# EAGLE design DE100-hw (EAGLE 9.6.2)
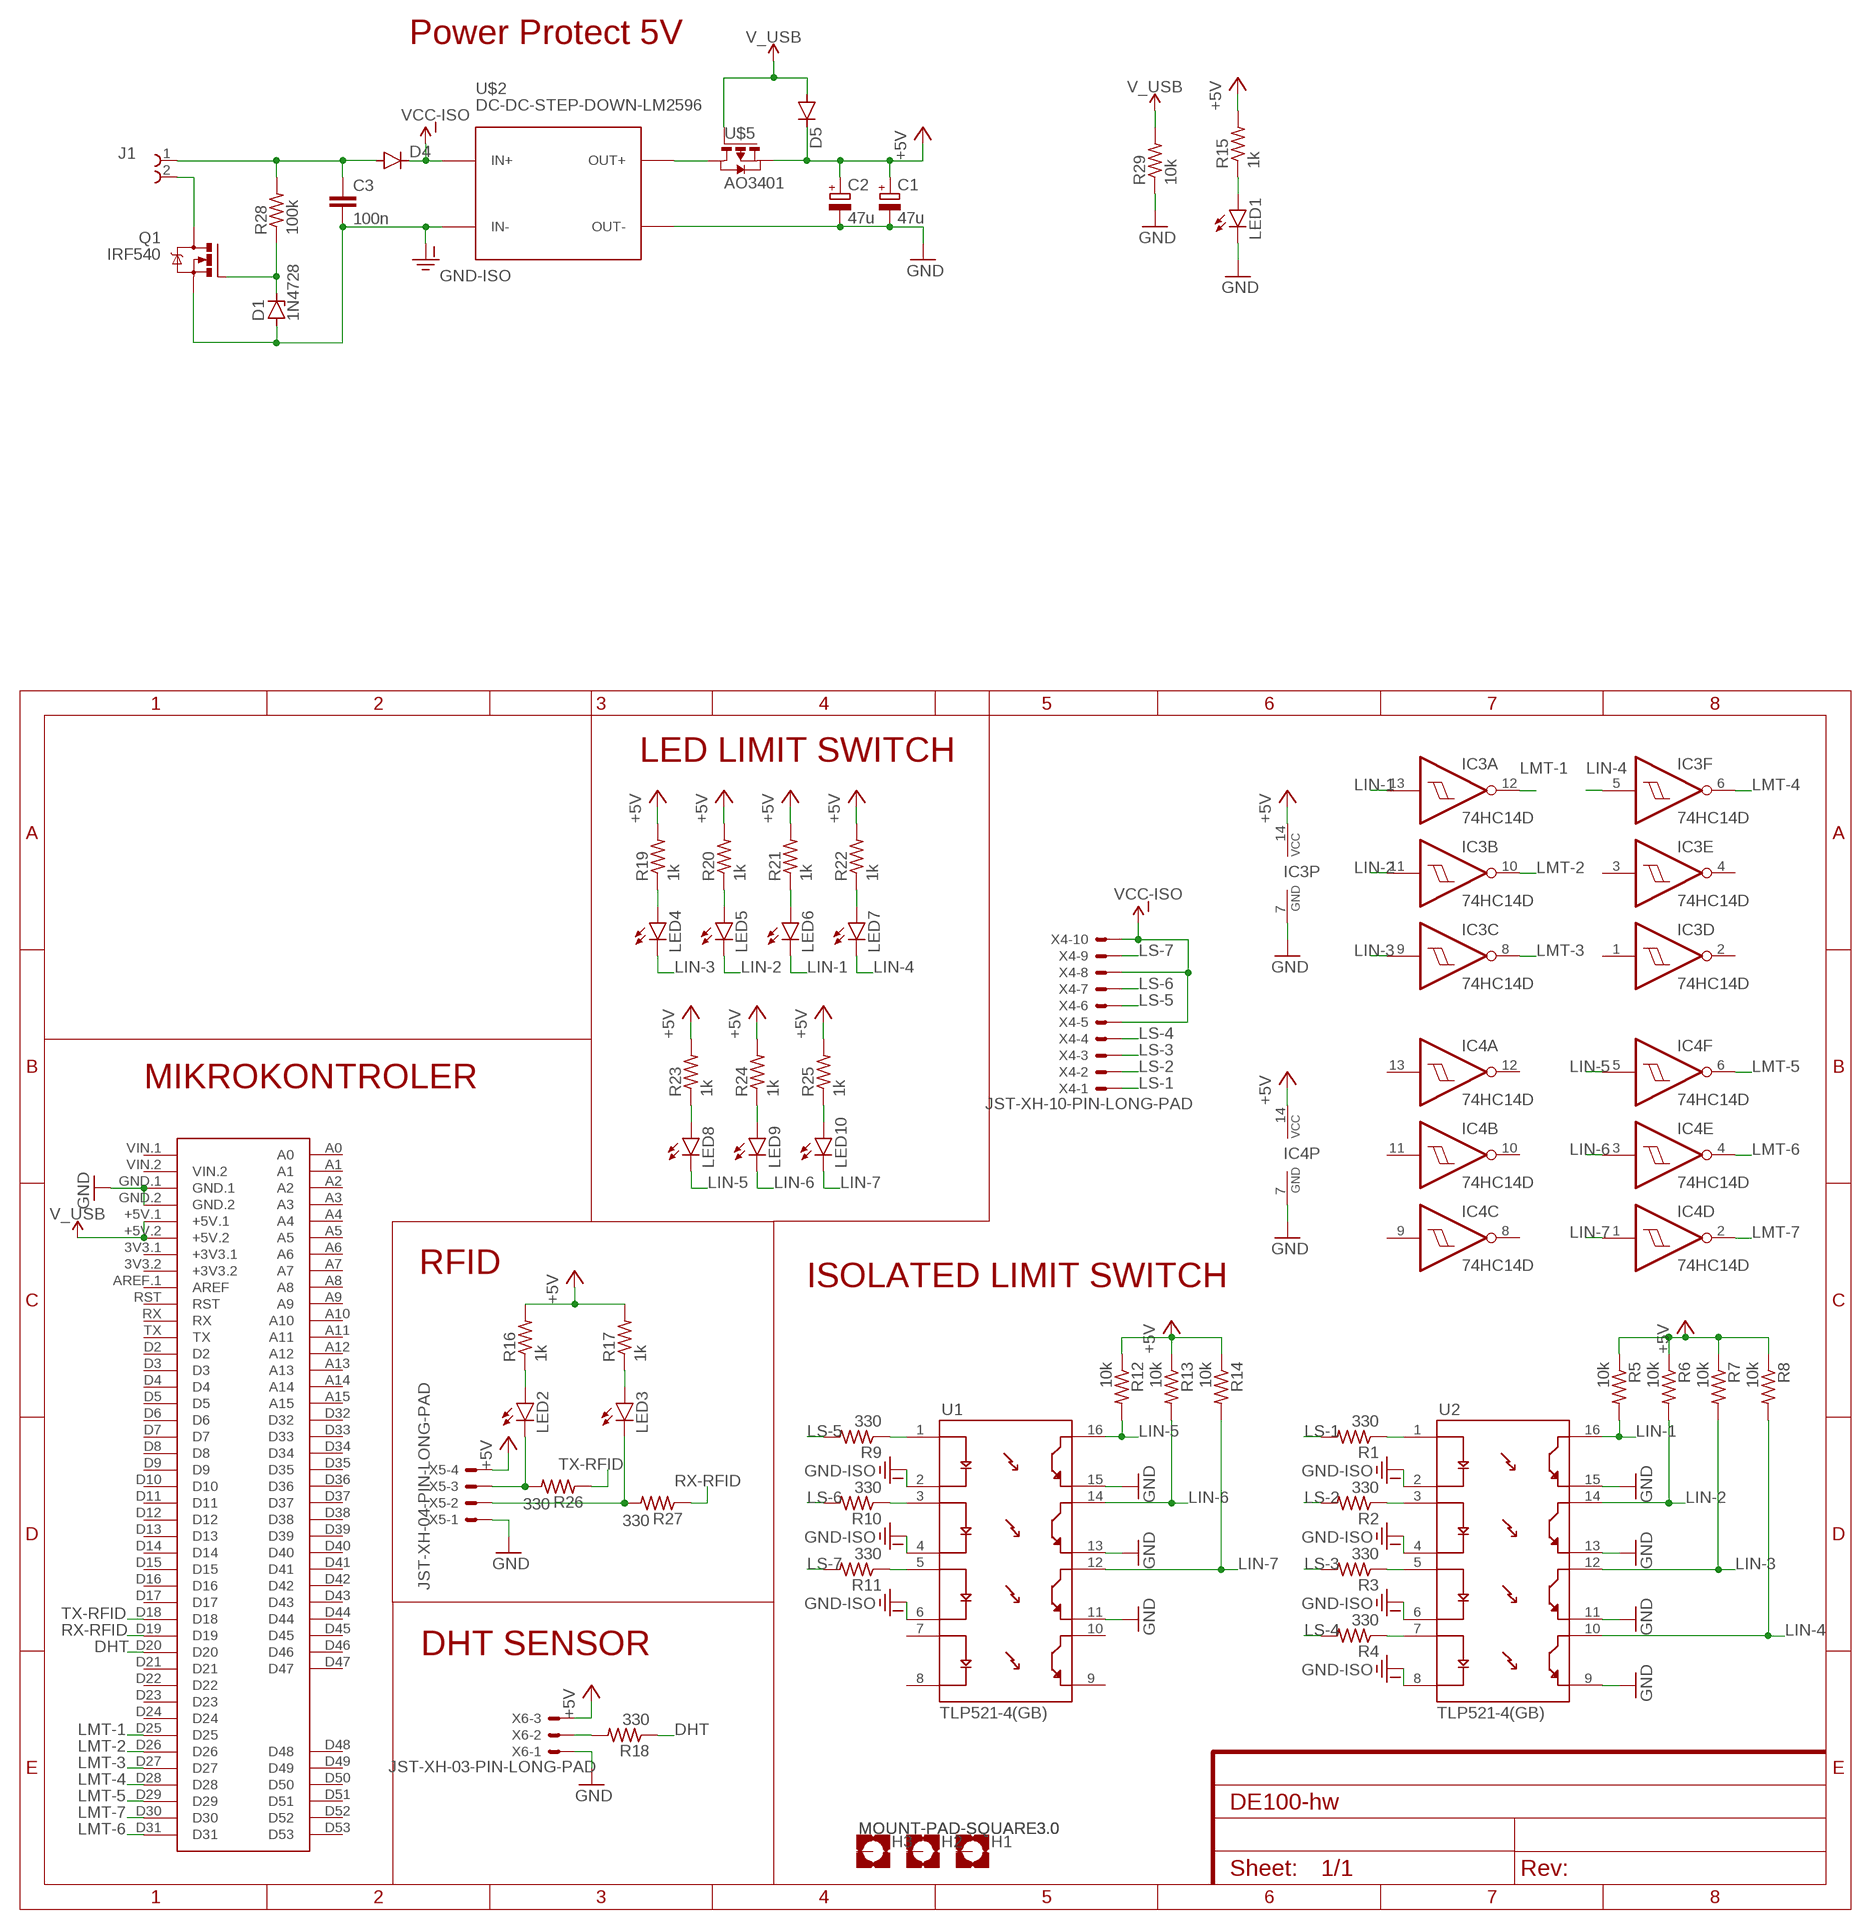
[diagram p0: schematic, sheet 1]

## Parts
C1  47u  CPOL-EUUD-6,3X8,8  [UD-6,3X5,8_NICHICON]
C2  47u  CPOL-EUUD-6,3X8,8  [UD-6,3X5,8_NICHICON]
C3  100n  C-EUC0805K  [C0805K]
D1  1N4728  [DO41Z10]
D4  DIODE-DO-214AC  [DO-214AC]
D5  DIODE-DO-214AC  [DO-214AC]
H1  MOUNT-PAD-SQUARE3.0  [3,0-PAD-SQUARE]
H2  MOUNT-PAD-SQUARE3.0  [3,0-PAD-SQUARE]
H3  MOUNT-PAD-SQUARE3.0  [3,0-PAD-SQUARE]
IC3  74HC14D  [SO14]
IC4  74HC14D  [SO14]
J1  691312510002  [691312510002]
LED1  LEDCHIPLED_0805  [CHIPLED_0805]
LED2  LEDCHIPLED_0805  [CHIPLED_0805]
LED3  LEDCHIPLED_0805  [CHIPLED_0805]
LED4  LEDCHIPLED_0805  [CHIPLED_0805]
LED5  LEDCHIPLED_0805  [CHIPLED_0805]
LED6  LEDCHIPLED_0805  [CHIPLED_0805]
LED7  LEDCHIPLED_0805  [CHIPLED_0805]
LED8  LEDCHIPLED_0805  [CHIPLED_0805]
LED9  LEDCHIPLED_0805  [CHIPLED_0805]
LED10  LEDCHIPLED_0805  [CHIPLED_0805]
Q1  IRF540  [TO220BV]
R1  330  R-US_R0805  [R0805]
R2  330  R-US_R0805  [R0805]
R3  330  R-US_R0805  [R0805]
R4  330  R-US_R0805  [R0805]
R5  10k  R-US_R0805  [R0805]
R6  10k  R-US_R0805  [R0805]
R7  10k  R-US_R0805  [R0805]
R8  10k  R-US_R0805  [R0805]
R9  330  R-US_R0805  [R0805]
R10  330  R-US_R0805  [R0805]
R11  330  R-US_R0805  [R0805]
R12  10k  R-US_R0805  [R0805]
R13  10k  R-US_R0805  [R0805]
R14  10k  R-US_R0805  [R0805]
R15  1k  R-US_R0805  [R0805]
R16  1k  R-US_R0805  [R0805]
R17  1k  R-US_R0805  [R0805]
R18  330  R-US_R0805  [R0805]
R19  1k  R-US_R0805  [R0805]
R20  1k  R-US_R0805  [R0805]
R21  1k  R-US_R0805  [R0805]
R22  1k  R-US_R0805  [R0805]
R23  1k  R-US_R0805  [R0805]
R24  1k  R-US_R0805  [R0805]
R25  1k  R-US_R0805  [R0805]
R26  330  R-US_R0805  [R0805]
R27  330  R-US_R0805  [R0805]
R28  100k  R-US_R0805  [R0805]
R29  10k  R-US_R0805  [R0805]
U1  TLP521-4(GB)  [DIP762W50P254L2007H485Q16]
U2  TLP521-4(GB)  [DIP762W50P254L2007H485Q16]
U$1  MEGA2560_MIKRO  [MEGA2560_MIKRO]
U$2  DC-DC-STEP-DOWN-LM2596  [DC-DC-STEP-DOWN-LM2596]
U$5  AO3401  [SOT23]
X4  JST-XH-10-PIN-LONG-PAD  [JST-XH-10-PACKAGE-LONG-PAD]
X5  JST-XH-04-PIN-LONG-PAD  [JST-XH-04-PACKAGE-LONG-PAD]
X6  JST-XH-03-PIN-LONG-PAD  [JST-XH-03-PACKAGE-LONG-PAD]

## Nets
+5V: C1.+ C2.+ D5.C IC3.14(P:VCC) IC4.14(P:VCC) R5.1 R6.1 R7.1 R8.1 R12.1 R13.1 R14.1 R15.2 R16.2 R17.2 R19.2 R20.2 R21.2 R22.2 R23.2 R24.2 R25.2 U$5.2(S) X5.4 X6.3
DHT: R18.1 U$1.D20
GND: C1.- C2.- IC3.7(P:GND) IC4.7(P:GND) LED1.C R29.1 U1.11(ET3) U1.13(ET2) U1.15(ET1) U2.9(ET4) U2.11(ET3) U2.13(ET2) U2.15(ET1) U$1.GND.1 U$1.GND.2 U$2.OUT- X5.1 X6.1
GND-ISO: C3.2 D1.A Q1.S U1.2(C1) U1.4(C2) U1.6(C3) U2.2(C1) U2.4(C2) U2.6(C3) U2.8(C4) U$2.IN-
LIN-1: IC3.13(A:I) LED6.C R5.2 U2.16(CT1)
LIN-2: IC3.11(B:I) LED5.C R6.2 U2.14(CT2)
LIN-3: IC3.9(C:I) LED4.C R7.2 U2.12(CT3)
LIN-4: IC3.5(F:I) LED7.C R8.2 U2.10(CT4)
LIN-5: IC4.5(F:I) LED8.C R12.2 U1.16(CT1)
LIN-6: IC4.3(E:I) LED9.C R13.2 U1.14(CT2)
LIN-7: IC4.1(D:I) LED10.C R14.2 U1.12(CT3)
LMT-1: IC3.12(A:O) U$1.D25
LMT-2: IC3.10(B:O) U$1.D26
LMT-3: IC3.8(C:O) U$1.D27
LMT-4: IC3.6(F:O) U$1.D28
LMT-5: IC4.6(F:O) U$1.D29
LMT-6: IC4.4(E:O) U$1.D31
LMT-7: IC4.2(D:O) U$1.D30
LS-1: R1.2 X4.1
LS-2: R2.2 X4.2
LS-3: R3.2 X4.3
LS-4: R4.2 X4.4
LS-5: R9.2 X4.6
LS-6: R10.2 X4.7
LS-7: R11.2 X4.9
N$1: J1.2 Q1.D
N$2: U$2.OUT+ U$5.3(D)
N$3: D1.C Q1.G R28.1
N$4: C3.1 D4.A J1.1 R28.2
N$17: LED1.A R15.1
N$18: LED2.A R16.1
N$23: LED3.A R17.1
N$24: R1.1 U2.1(A1)
N$25: R2.1 U2.3(A2)
N$26: R3.1 U2.5(A3)
N$27: R4.1 U2.7(A4)
N$32: R9.1 U1.1(A1)
N$33: R10.1 U1.3(A2)
N$34: R11.1 U1.5(A3)
N$35: LED2.C R26.2 X5.3
N$36: LED3.C R27.2 X5.2
N$37: LED4.A R19.1
N$38: R18.2 X6.2
N$41: LED5.A R20.1
N$44: LED6.A R21.1
N$49: LED7.A R22.1
N$50: LED8.A R23.1
N$51: LED9.A R24.1
N$52: LED10.A R25.1
RX-RFID: R27.1 U$1.D19
TX-RFID: R26.1 U$1.D18
V_USB: D5.A R29.2 U$1.+5V.1 U$1.+5V.2 U$5.1(G)
VCC-ISO: D4.C U$2.IN+ X4.5 X4.8 X4.10
Unconnected: H1.B3,0(MOUNT) H2.B3,0(MOUNT) H3.B3,0(MOUNT) IC3.1(D:I) IC3.2(D:O) IC3.3(E:I) IC3.4(E:O) IC4.8(C:O) IC4.9(C:I) IC4.10(B:O) IC4.11(B:I) IC4.12(A:O) IC4.13(A:I) U1.7(A4) U1.8(C4) U1.9(ET4) U1.10(CT4) U$1.3V3.1(+3V3.1) U$1.3V3.2(+3V3.2) U$1.A0 U$1.A1 U$1.A2 U$1.A3 U$1.A4 U$1.A5 U$1.A6 U$1.A7 U$1.A8 U$1.A9 U$1.A10 U$1.A11 U$1.A12 U$1.A13 U$1.A14 U$1.A15 U$1.AREF.1(AREF) U$1.D2 U$1.D3 U$1.D4 U$1.D5 U$1.D6 U$1.D7 U$1.D8 U$1.D9 U$1.D10 U$1.D11 U$1.D12 U$1.D13 U$1.D14 U$1.D15 U$1.D16 U$1.D17 U$1.D21 U$1.D22 U$1.D23 U$1.D24 U$1.D32 U$1.D33 U$1.D34 U$1.D35 U$1.D36 U$1.D37 U$1.D38 U$1.D39 U$1.D40 U$1.D41 U$1.D42 U$1.D43 U$1.D44 U$1.D45 U$1.D46 U$1.D47 U$1.D48 U$1.D49 U$1.D50 U$1.D51 U$1.D52 U$1.D53 U$1.RST U$1.RX U$1.TX U$1.VIN.1 U$1.VIN.2

## Notes on the sheet
- Power Protect 5V
- LED LIMIT SWITCH
- MIKROKONTROLER
- RFID
- ISOLATED LIMIT SWITCH
- DHT SENSOR

## Library data of the parts
C1 C2 = rcl:CPOL-EU: POLARIZED CAPACITOR, European symbol; SPICEPREFIX: C
C3 = rcl:C-EU: CAPACITOR, European symbol; SPICEPREFIX: C
D1 = diode:1N4728: Z DIODE 3.3 V, 1W, 5 percent
D4 D5 = diode:DIODE-: DIODE
H1-H3 = holes:MOUNT-PAD-SQUARE: MOUNTING PAD, square
IC3 IC4 = 74xx-eu:74*14: Hex schmitt trigger INVERTER
J1 = Wurth_Elektronik_Electromechanic_Terminal_Blocks_Connectors_rev16b:691312510002: WR-TBL Serie 312 - 5.08 mm Open Horizontal PCB Header , 2 Pins=>Code : Con_TBL_Pluggable_5.08_PCB_THT_Simple_H_691312510002 <http://katalog.we-online.de/media/images/eican/Con_TBL_Pluggable_5.08_PCB_THT_Simple_H_6913125100xx_pf2.jpg> Details see: http://katalog.we-online.de/en/em/691_312_510_0xx Created 2014-06-25, Karrer Zheng 2014 (C) Würth Elektronik
LED1-LED10 = led:LED: LED OSRAM: - CHIPLED LG R971, LG N971, LY N971, LG Q971, LY Q971, LO R971, LY R971 LH N974, LH R974 LS Q976, LO Q976, LY Q976 LO Q996 - Hyper CHIPLED LW Q18S LB Q993, LB Q99A, LB R99A - SideLED LS A670, LO A670, LY A670, LG A670, LP A670 LB A673, LV A673, LT A673, LW A673 LH A674 LY A675 LS A676, LA A676, LO A676, LY A676, LW A676 LS A679, LY A679, LG A679 - Hyper Micro SIDELED® LS Y876, LA Y876, LO Y876, LY Y876 LT Y87S - SmartLED LW L88C, LW L88S LB L89C, LB L89S, LG L890 LS L89K, LO L89K, LY L89K LS L896, LA L896, LO L896, LY L896 - TOPLED LS T670, LO T670, LY T670, LG T670, LP T670 LSG T670, LSP T670, LSY T670, LOP T670, LYG T670 LG T671, LOG T671, LSG T671 LB T673, LV T673, LT T673, LW T673 LH T674 LS T676, LA T676, LO T676, LY T676, LB T676, LH T676, LSB T676, LW T676 LB T67C, LV T67C, LT T67C, LS T67K, LO T67K, LY T67K, LW E67C LS E67B, LA E67B, LO E67B, LY E67B, LB E67C, LV E67C, LT E67C LW T67C LS T679, LY T679, LG T679 LS T770, LO T770, LY T770, LG T770, LP T770 LB T773, LV T773, LT T773, LW T773 LH T774 LS E675, LA E675, LY E675, LS T675 LS T776, LA T776, LO T776, LY T776, LB T776 LHGB T686 LT T68C, LB T68C - Hyper Mini TOPLED® LB M676 - Mini TOPLED Santana® LG M470 LS M47K, LO M47K, LY M47K Source: http://www.osram.convergy.de LUXEON: - LUMILED® LXK2-PW12-R00, LXK2-PW12-S00, LXK2-PW14-U00, LXK2-PW14-V00 LXK2-PM12-R00, LXK2-PM12-S00, LXK2-PM14-U00 LXK2-PE12-Q00, LXK2-PE12-R00, LXK2-PE12-S00, LXK2-PE14-T00, LXK2-PE14-U00 LXK2-PB12-K00, LXK2-PB12-L00, LXK2-PB12-M00, LXK2-PB14-N00, LXK2-PB14-P00, LXK2-PB14-Q00 LXK2-PR12-L00, LXK2-PR12-M00, LXK2-PR14-Q00, LXK2-PR14-R00 LXK2-PD12-Q00, LXK2-PD12-R00, LXK2-PD12-S00 LXK2-PH12-R00, LXK2-PH12-S00 LXK2-PL12-P00, LXK2-PL12-Q00, LXK2-PL12-R00 Source: www.luxeon.com KINGBRIGHT: KA-3528ASYC Source: www.kingbright.com
Q1 = transistor-power:IRF540: HEXFET Power MOSFET
R1-R29 = rcl:R-US_: RESISTOR, American symbol; SPICEPREFIX: R
U1 U2 = TLP521-4_GB_:TLP521-4(GB): Optocoupler, Quad, Transistor o/p; AVAILABILITY: Unavailable; DESCRIPTION: Optocoupler, Quad, Transistor o/p; MF: Toshiba; MP: TLP521-4_GB_; PACKAGE: DIP-16 Toshiba; PRICE: None
U$1 = MIKRO_MEGA2560:MEGA2560_MIKRO: Arduino Mega2560 pro robotDyn, create by mikroavr.com
U$2 = diy-modules:DC-DC-STEP-DOWN-LM2596: DC/DC Step-Down Regulator based on LM2596-ADJ chip LM2596 datasheet available here: http://www.ti.com/lit/ds/symlink/lm2596.pdf Click here to find device on ebay.com <http://www.ebay.com/sch/lm2596+power+regulator>
U$5 = AO3401:AO3401: Check prices <https://pricing.snapeda.com/parts/AO3401/Alpha%20%26%20Omega%20Semiconductor/view-part?ref=eda>; AVAILABILITY: Warning; DESCRIPTION: P-Channel 30V 4A (Ta) 1.4W (Ta) Surface Mount SOT-23-3L; MF: Alpha & Omega Semiconductor; MP: AO3401; PACKAGE: SOT-23-3 Alpha &amp; Omega Semiconductor; PRICE: None
X4 = Rembrandt Electronics - JST XH Connectors v1-0:JST-XH-10-PIN: JST XH Connector 2 Pin Wire to board connector. Pitch: 2,54 mm, (0.100") Number of pins: 10 Created by Rembrandt Electronics www.rembrandtelectronics.com
X5 = Rembrandt Electronics - JST XH Connectors v1-0:JST-XH-04-PIN: JST XH Connector 2 Pin Wire to board connector. Pitch: 2,54 mm, (0.100") Number of pins: 4 Created by Rembrandt Electronics www.rembrandtelectronics.com
X6 = Rembrandt Electronics - JST XH Connectors v1-0:JST-XH-03-PIN: JST XH Connector 2 Pin Wire to board connector. Pitch: 2,54 mm, (0.100") Number of pins: 3 Created by Rembrandt Electronics www.rembrandtelectronics.com

## Board
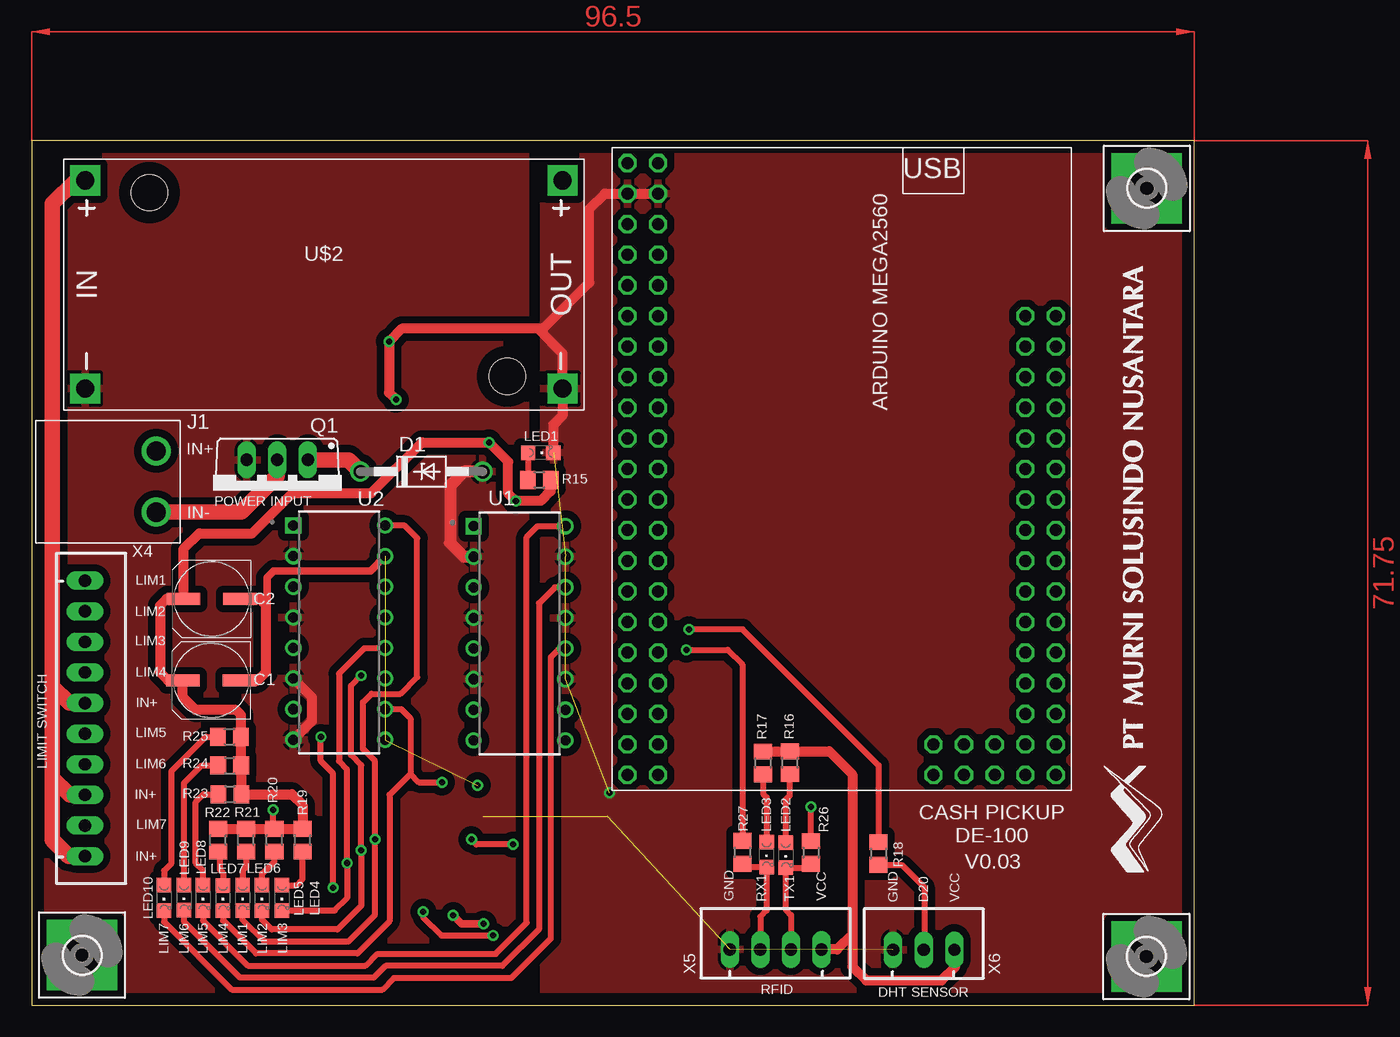
[diagram p1: board, top side]
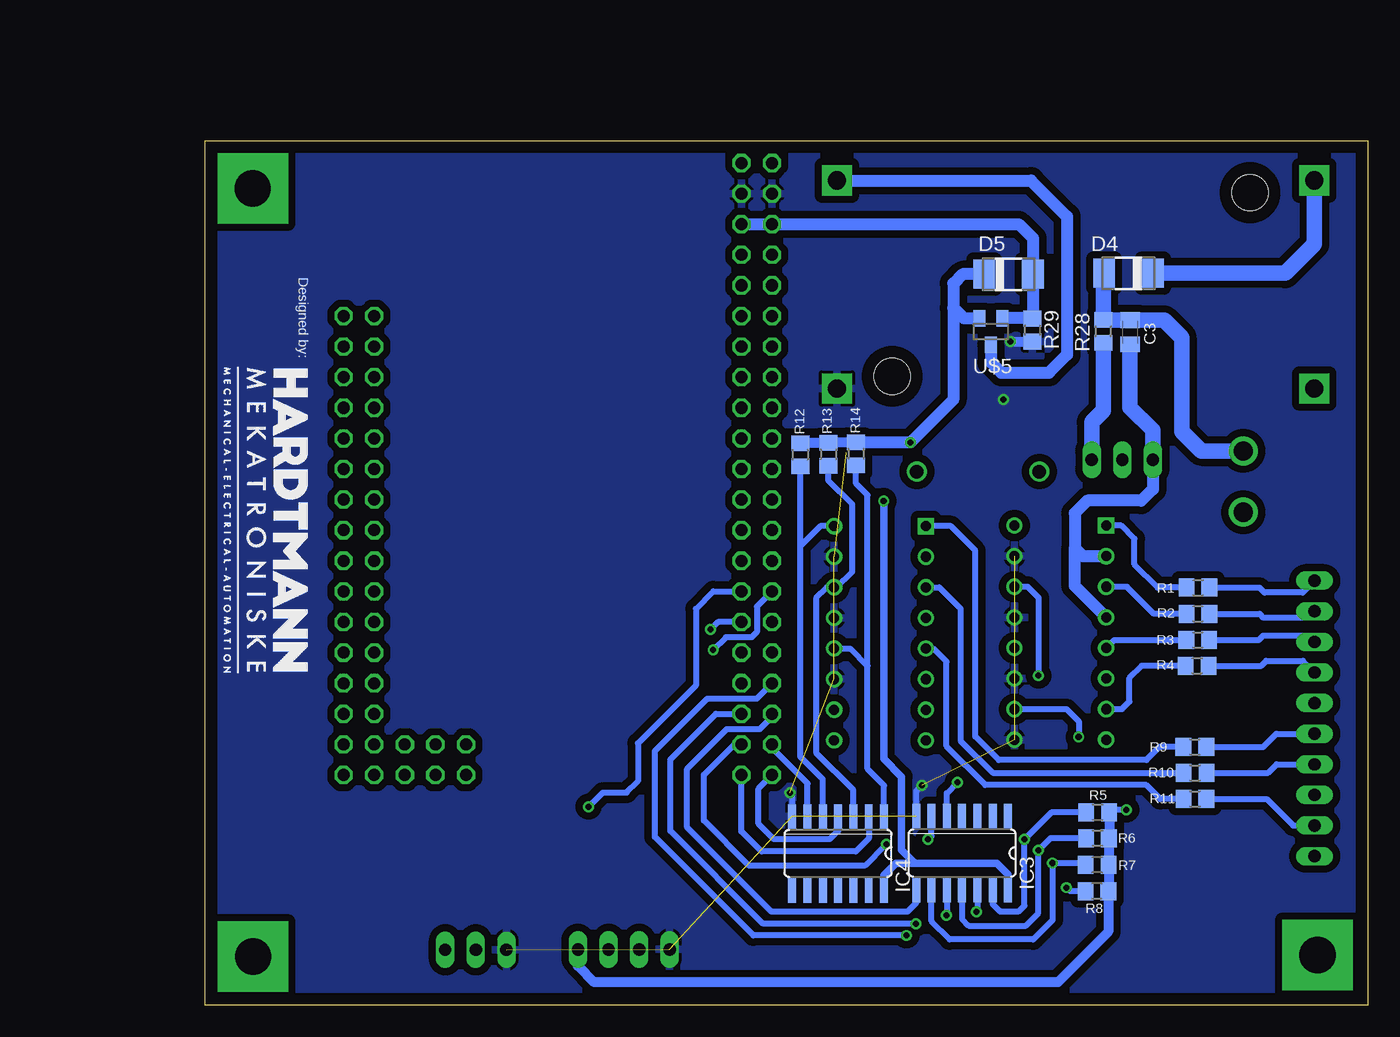
[diagram p2: board, bottom side, seen from below]

Size 96.5 x 71.75 mm. Coordinates in mm from the lower left corner, seen from the top.
Outline: 0,0 96.5,0 96.5,71.75 0,71.75 0,0
Copper layers (1*16): Top 0.035mm / dielectric 1.5mm / Bottom 0.035mm
Design rules "Multikarya": minimum track width 0.2mm, minimum drill 0.35mm, track to track 0.2mm, track to pad 0.2mm, pad to pad 0.2mm, via to via 0.2mm, smd to smd 0.2mm, copper to edge 40mil, drill to drill 6mil, minimum pad ring 10mil, minimum via ring 8mil, stop-mask expansion 4mil, vias tented up to drill 0mil, thermal gap 10mil

### Footprints (pad centres in the part's own frame; a part is rotated, then mirrored left to right if it is on the bottom)
UD-6,3X5,8_NICHICON = smd 2.8 x 1: + 2.35,0; - -2.35,0
C0805K = smd 1.3 x 1.6: 1 -1,0; 2 1,0
DO41Z10 = drill 1.118: A 5.08,0; C -5.08,0
DO-214AC = smd 1.8 x 2.4: A 2.025,0; C -2.025,0
3,0-PAD-SQUARE = drill 3 pad 5.842 square: B3,0 0,0
SO14 = smd 0.66 x 2.032: 1 -3.81,-3.073; 2 -2.54,-3.073; 3 -1.27,-3.073; 4 0,-3.073; 5 1.27,-3.073; 6 2.54,-3.073; 7 3.81,-3.073; 8 3.81,3.073; 9 2.54,3.073; 10 1.27,3.073; 11 0,3.073; 12 -1.27,3.073; 13 -2.54,3.073; 14 -3.81,3.073
691312510002 = drill 1.6: 1 -5.08,0; 2 0,0
CHIPLED_0805 = smd 1.2 x 1.2: A 0,-1.05; C 0,1.05
TO220BV = drill 1.016 long: D 0,-2.54; G -2.54,-2.54; S 2.54,-2.54
R0805 = smd 1.3 x 1.5: 1 -0.95,0; 2 0.95,0
DIP762W50P254L2007H485Q16 = drill 0.84 square: 1 -3.81,8.89 | drill 0.84: 2 -3.81,6.35; 3 -3.81,3.81; 4 -3.81,1.27; 5 -3.81,-1.27; 6 -3.81,-3.81; 7 -3.81,-6.35; 8 -3.81,-8.89; 9 3.81,-8.89; 10 3.81,-6.35; 11 3.81,-3.81; 12 3.81,-1.27; 13 3.81,1.27; 14 3.81,3.81; 15 3.81,6.35; 16 3.81,8.89
MEGA2560_MIKRO = drill 1 octagon: 3V3.1 -26.67,-17.78; 3V3.2 -26.67,-20.32; +5V.1 -29.21,-17.78; +5V.2 -29.21,-20.32; A0 -21.59,15.24; A1 -21.59,12.7; A2 -19.05,15.24; A3 -19.05,12.7; A4 -16.51,15.24; A5 -16.51,12.7; A6 -13.97,15.24; A7 -13.97,12.7; A8 -11.43,15.24; A9 -11.43,12.7; A10 -8.89,15.24; A11 -8.89,12.7; A12 -6.35,15.24; A13 -6.35,12.7; A14 -3.81,15.24; A15 -3.81,12.7; AREF.1 -24.13,-17.78; D2 -19.05,-17.78; D3 -19.05,-20.32; D4 -16.51,-17.78; D5 -16.51,-20.32; D6 -13.97,-17.78; D7 -13.97,-20.32; D8 -11.43,-17.78; D9 -11.43,-20.32; D10 -8.89,-17.78; D11 -8.89,-20.32; D12 -6.35,-17.78; D13 -6.35,-20.32; D14 -3.81,-17.78; D15 -3.81,-20.32; D16 -1.27,-17.78; D17 -1.27,-20.32; D18 1.27,-17.78; D19 1.27,-20.32; D20 3.81,-17.78; D21 3.81,-20.32; D22 6.35,-17.78; D23 6.35,-20.32; D24 8.89,-17.78; D25 8.89,-20.32; D26 11.43,-17.78; D27 11.43,-20.32; D28 13.97,-17.78; D29 13.97,-20.32; D30 16.51,-17.78; D31 16.51,-20.32; D32 -1.27,15.24; D33 -1.27,12.7; D34 1.27,15.24; D35 1.27,12.7; D36 3.81,15.24; D37 3.81,12.7; D38 6.35,15.24; D39 6.35,12.7; D40 8.89,15.24; D41 8.89,12.7; D42 11.43,15.24; D43 11.43,12.7; D44 13.97,15.24; D45 13.97,12.7; D46 16.51,15.24; D47 16.51,12.7; D48 16.51,10.16; D49 13.97,10.16; D50 16.51,7.62; D51 13.97,7.62; D52 16.51,5.08; D53 13.97,5.08; GND.1 -31.75,-17.78; GND.2 -31.75,-20.32; RST -24.13,-20.32; RX -21.59,-17.78; TX -21.59,-20.32; VIN.1 -34.29,-17.78; VIN.2 -34.29,-20.32
DC-DC-STEP-DOWN-LM2596 = drill 1.5 pad 2.5 square: IN+ -19.812,8.636; IN- -19.812,-8.636; OUT+ 19.812,8.636; OUT- 19.812,-8.636 | hole 3: -14.478,7.62; 15.24,-7.62
SOT23 = smd 1 x 1.4: 1 -0.95,-1.1; 2 0.95,-1.1; 3 0,1.1
JST-XH-10-PACKAGE-LONG-PAD = drill 1.016 long: 1 -11.43,0; 2 -8.89,0; 3 -6.35,0; 4 -3.81,0; 5 -1.27,0; 6 1.27,0; 7 3.81,0; 8 6.35,0; 9 8.89,0; 10 11.43,0
JST-XH-04-PACKAGE-LONG-PAD = drill 1.016 long: 1 -3.81,0; 2 -1.27,0; 3 1.27,0; 4 3.81,0
JST-XH-03-PACKAGE-LONG-PAD = drill 1.016 long: 1 -2.54,0; 2 0,0; 3 2.54,0

### Placement (x,y rotation side)
C1  14.89,26.95 180 top
C2  14.94,33.72 180 top
C3  19.73,55.85 270 bottom
D1  32.34,44.28 0 top
D4  19.87,60.74 180 bottom
D5  29.81,60.67 0 bottom
H1  4.17,4.15 0 top
H2  92.51,4.04 0 top
H3  92.54,67.79 0 top
IC3  33.67,12.61 180 bottom
IC4  43.96,12.59 180 bottom
J1  10.33,40.92 270 top
LED1  42.24,45.85 270 top
LED2  62.58,12.45 180 top
LED3  60.98,12.49 180 top
LED4  20.77,8.91 180 top
LED5  19.12,8.91 180 top
LED6  17.51,8.9 180 top
LED7  15.87,8.89 180 top
LED8  14.22,8.91 180 top
LED9  12.65,8.92 180 top
LED10  10.99,8.91 180 top
Q1  20.38,42.72 180 top
R1  14.1,34.65 0 bottom
R2  14.1,32.48 0 bottom
R3  14.11,30.31 0 bottom
R4  14.17,28.17 0 bottom
R5  22.42,15.99 180 bottom
R6  22.44,13.84 180 bottom
R7  22.46,11.64 180 bottom
R8  22.48,9.45 180 bottom
R9  14.36,21.43 0 bottom
R10  14.34,19.28 0 bottom
R11  14.35,17.12 0 bottom
R12  47.1,45.67 270 bottom
R13  44.77,45.72 270 bottom
R14  42.47,45.75 270 bottom
R15  42.14,43.6 0 top
R16  62.93,20.12 90 top
R17  60.7,20.1 90 top
R18  70.28,12.59 270 top
R19  22.48,13.68 90 top
R20  20.14,13.68 90 top
R21  17.78,13.68 90 top
R22  15.46,13.68 90 top
R23  16.45,17.5 0 top
R24  16.43,19.89 0 top
R25  16.42,22.28 0 top
R26  64.68,12.67 270 top
R27  58.98,12.68 270 top
R28  21.94,55.92 90 bottom
R29  27.82,56.03 90 bottom
U1  40.48,30.87 0 top
U2  25.52,30.92 0 top
U$1  69.76,35.61 270 top
U$2  24.24,59.81 0 top
U$5  31.29,55.9 180 bottom
X4  4.41,23.8 270 top
X5  61.74,4.62 0 top
X6  74.04,4.6 0 top

### Tracks (layer width: path | path; a pad name or v marks a point on that pad's centre or on a via)
+5V  (via drill 0.5)
  Top 0.508: R20.2 20.04,14.74 v20.04,16.21
  Top 0.813: R17.2 60.72,21.06 R16.2 66.19,21.06 68.11,19.14 68.11,5.89 | 68.11,5.89 68.11,3.2 69.26,2.04 75.52,2.04 76.61,3.14 76.61,4.56 X6.3 | R22.2 R21.2 R20.2 R19.2 22.48,16.61 21.59,17.5 R23.2 17.4,19.86 R24.2 17.37,19.9 R25.2 17.37,24.08 16.95,24.5 13.61,24.5 12.54,25.56 C1.+ 11.32,26.95 10.65,27.62 10.65,33.17 11.2,33.72 C2.+ 12.59,37.84 13.9,39.15 18.31,39.15 21.65,42.49 28.19,42.49 32.4,46.7 v37.95,46.7 39.54,45.11 39.54,42.48 v40.18,41.84 42.25,41.84 43.07,42.66 43.07,43.59 R15.2 | X5.4 66.84,4.62 68.11,5.89
  Bottom 0.508: v20.04,16.21 21.24,16.21 R5.1
  Bottom 0.61: IC4.14 40.15,10.76 39.16,11.75 37.59,11.75 | 37.59,11.75 30.77,11.75 29.86,10.84 IC3.14 | 37.59,11.75 38.7,12.87 38.7,18.96 40.18,20.43 v40.18,41.84
  Bottom 0.813: R5.1 21.47,13.87 R6.1 21.51,13.82 R7.1 21.51,9.47 R8.1 21.53,6.1 25.72,1.91 64.21,1.91 65.55,3.26 X5.4 | R14.1 44.73,46.7 R13.1 47.05,46.67 R12.1
  Bottom 1.016: D5.C 33.64,60.67 34.4,59.9 34.4,57.88 | 34.4,57.88 33.52,57 U$5.2 | R14.1 v37.95,46.7 34.4,50.25 34.4,57.88
DHT  (via drill 0.5)
  Top 0.508: R18.1 70.28,19.91 59,31.19 v54.55,31.19
  Bottom 0.508: U$1.D20 53.94,31.8 v54.55,31.19
GND  (via drill 0.5)  (11 unrouted)
  Top 0.61: U2.15 28.11,36.04 20.09,36.04 19.53,35.48 19.53,33.3 19.43,33.2
  Top 0.813: LED1.C 43.29,48.2 44.06,48.96 | 44.06,48.96 44.08,48.99 | U$1.GND.1 U$1.GND.2 47.58,67.36 46.27,66.05 46.27,59.97 42.45,56.15 42.01,56.15 | 42.01,56.15 44.06,54.09 U$2.OUT- 44.06,48.96 | 42.01,56.15 30.7,56.15 v29.65,55.09 29.65,50.84 v30.23,50.25 | C2.- 18.91,33.72 19.43,33.2 19.43,27.62 18.75,26.95 C1.-
  Bottom 0.508: IC3.7 37.48,17.77 v37,18.25 | v47.97,17.63 47.77,17.43 IC4.7
  Bottom 0.813: v29.65,55.09 29.64,55.08 R29.1
  pour Top (isolate 0.61): 42.5,71.75 42.5,0 96.5,0 96.5,71.75
  pour Bottom (isolate 0.61): 0,71.75 96.5,71.75 96.5,0 0,0
GND-ISO
  Top 0.813: U2.8 23.26,23.57 23.26,25.56 U2.6
  Top 1.016: D1.A 35.85,44.28 34.7,43.14 34.7,38.36 35.85,37.22 U1.2
  Bottom 1.016: Q1.S 17.84,42.84 18.8,41.87 23.29,41.87 24.33,40.83 24.33,37.93 | U2.2 23.66,37.27 24.33,37.93 | U2.4 24.33,34.8 24.33,37.93
  Bottom 1.27: C3.2 19.73,49.62 17.84,47.72 Q1.S
  pour Top (isolate 0.61): 0,0 0,71.75 41,71.75 41,0
LIN-1  (via drill 0.5)
  Top 0.508: LED6.C 17.51,7.05 19.28,5.28 26.29,5.28 28.5,7.49 v28.5,13.75 28.5,20.25 27.5,21.25 27.5,25.13 28.2,25.83 30.61,25.83 32,27.22 32,38.75 30.95,39.8 U2.16
  Bottom 0.508: R5.2 26.27,15.99 v28.5,13.75 28.5,8.25 29,7.75 30.5,7.75 31.13,8.38 IC3.13
LIN-2  (via drill 0.5)
  Top 0.508: LED5.C 19.12,7.09 19.92,6.28 25.38,6.28 27.34,8.25 v27.34,12.84 27.34,19.91 26.5,20.75 26.5,26.51 v27.33,27.35
  Bottom 0.508: R6.2 26.34,13.84 v27.34,12.84 27.34,7.63 28.37,6.6 33.13,6.6 33.67,7.14 IC3.11 | U2.14 28.23,34.72 27.33,33.83 v27.33,27.35
LIN-3  (via drill 0.5)
  Top 0.508: LED4.C 25.16,7.86 26.18,8.88 v26.18,11.79 26.18,19.58 25.5,20.25 25.5,27.52 27.62,29.64 U2.12
  Bottom 0.508: R7.2 23.56,11.79 v26.18,11.79 26.18,7.04 27.77,5.45 34.69,5.45 36.21,6.96 IC3.9
LIN-4  (via drill 0.5)
  Top 0.508: LED7.C 15.87,7.03 18.61,4.29 27.03,4.29 29.7,6.96 29.7,17.46 31.43,19.18 | v24,22.25 24,20.25 25,19.25 v25,9.75 | U2.10 30.66,24.56 31.43,23.8 31.43,19.18 | 31.43,19.18 32.12,18.49 v34.04,18.49
  Bottom 0.508: IC3.5 34.94,17.59 v34.04,18.49 | R8.2 24.7,9.45 v25,9.75 | U2.10 25.02,24.56 24,23.55 v24,22.25
LIN-5
  Top 0.508: LED8.C 14.22,7 17.94,3.29 27.7,3.29 28.67,4.25 38.5,4.25 41.09,6.84 41.09,38.84 42,39.76 U1.16
  Bottom 0.508: IC4.5 45.23,18.75 47.1,20.61 47.1,38.1 | 47.1,38.1 R12.2 | U1.16 45.44,39.76 47.1,38.1
LIN-6
  Top 0.508: U1.14 43.42,34.68 42.09,33.34 42.09,6.29 39.05,3.25 29.36,3.25 28.39,2.29 17.29,2.29 12.65,6.93 LED9.C
  Bottom 0.508: R13.2 44.77,43.55 42.79,41.57 42.79,35.96 44.08,34.68 U1.14 44.9,34.68 45.79,33.79 45.79,20.95 42.69,17.85 IC4.3
LIN-7
  Top 0.508: LED10.C 10.99,6.91 16.61,1.29 29.1,1.29 30.07,2.25 39.81,2.25 43.09,5.54 43.09,28.89 43.8,29.6 U1.12
  Bottom 0.508: IC4.1 40.15,18.24 41.52,19.61 41.52,28.17 | 41.52,28.17 42.94,29.6 U1.12 | 41.52,28.17 41.52,42.33 42.47,43.29 R14.2
LMT-1  (via drill 0.5)
  Top 0.508: v32.5,7.75 32.5,7.25 33.98,5.78 v38.29,5.78
  Bottom 0.508: v38.29,5.78 51,5.78 59.17,13.95 59.17,21.08 54.81,25.45 50.71,25.45 U$1.D25 | IC3.12 32.4,7.85 v32.5,7.75
LMT-2  (via drill 0.5)
  Top 0.61: v34.98,7.45 35.68,6.75 v37.5,6.75
  Bottom 0.508: v34.98,7.45 34.94,7.49 IC3.10 | v37.5,6.75 50.19,6.75 57.88,14.45 57.88,20.39 54.1,24.18 U$1.D26
LMT-3
  Bottom 0.508: U$1.D27 49.44,23.92 50.45,22.91 53.19,22.91 56.49,19.61 56.49,14.75 49.5,7.75 38.2,7.75 37.48,8.47 IC3.8
LMT-4  (via drill 0.5)
  Top 0.508: v39.94,13.33 36.92,13.33 v36.5,13.75
  Bottom 0.508: U$1.D28 52.57,21.64 55.1,19.11 55.1,15.31 51.4,11.62 41.69,11.62 39.97,13.33 v39.94,13.33 | v36.5,13.75 36.21,14.04 IC3.6
LMT-5
  Bottom 0.508: IC4.6 46.5,18.39 49.44,21.33 U$1.D29
LMT-6
  Bottom 0.508: IC4.4 43.96,14.46 44.66,13.76 49.3,13.76 50.57,15.03 50.57,17.97 U$1.D31
LMT-7
  Bottom 0.508: IC4.2 41.42,13.83 42.5,12.75 50.32,12.75 51.98,14.42 U$1.D30
LS-1
  Bottom 0.508: X4.1 5.41,34.24 8.58,34.24 8.99,34.65 R1.2
LS-2
  Bottom 0.508: X4.2 4.57,32.69 5.1,32.16 8.66,32.16 8.98,32.48 R2.2
LS-3
  Bottom 0.508: X4.3 4.95,30.68 8.68,30.68 9.05,30.31 R3.2
LS-4
  Bottom 0.508: X4.4 5.38,28.57 8.43,28.57 8.83,28.17 R4.2
LS-5
  Bottom 0.508: R9.2 8.69,21.43 7.59,22.53 X4.6
LS-6
  Bottom 0.508: R10.2 8.27,19.28 7.56,19.99 X4.7
LS-7
  Bottom 0.508: R11.2 8.4,17.12 6.19,14.91 X4.9
N$1
  Top 1.27: J1.2 17.39,40.92 20.38,43.9 Q1.D
N$2
  Bottom 1.016: U$5.3 31.29,53.36 30.41,52.49 26.46,52.49 24.96,53.99 24.96,65.45 27.96,68.45 U$2.OUT+
N$3
  Top 1.27: D1.C 26.28,45.26 Q1.G
  Bottom 1.27: R28.1 21.94,49.36 22.92,48.38 Q1.G
N$4
  Bottom 0.61: R28.2 21.93,56.85
  Bottom 1.27: 21.93,56.85 C3.1 16.9,56.85 15.45,55.41 15.45,47.61 13.84,46 J1.1 | R28.2 21.94,60.7 D4.A
N$17
  Top 0.508: LED1.A R15.1
N$18
  Top 0.508: LED2.A 62.58,17.06 62.93,17.4 R16.1
N$23
  Top 0.508: R17.1 60.7,17.55 61,17.25 61,13.56 LED3.A
N$24
  Bottom 0.508: R1.1 17.43,34.65 19.36,36.58 19.36,38.7 20.46,39.8 U2.1
N$25
  Bottom 0.508: R2.1 17.75,32.48 20,34.72 U2.3
N$26
  Bottom 0.508: U2.5 21.05,30.31 R3.1
N$27
  Bottom 0.508: R4.1 18.77,28.17 19.78,27.15 19.78,25.2 20.41,24.56 U2.7
N$32
  Bottom 0.508: U1.1 34.6,39.76 32.57,37.73 32.57,22.29 30.62,20.34 18.37,20.34 17.28,21.43 R9.1
N$33
  Bottom 0.508: U1.3 35.57,34.68 33.8,32.91 33.8,21.94 31.14,19.28 R10.1
N$34
  Bottom 0.508: U1.5 36.06,29.6 34.97,28.51 34.97,21.49 31.75,18.28 18.4,18.28 17.24,17.12 R11.1
N$35
  Top 0.508: R26.2 64.35,11.4 LED2.C 62.58,7.92 63.03,7.47 63.03,4.64 X5.3
N$36
  Top 0.508: R27.2 59.27,11.44 LED3.C 60.98,7.85 60.47,7.34 X5.2
N$37
  Top 0.508: LED4.A 21.97,9.96 22.48,10.48 R19.1
N$38
  Top 0.508: R18.2 72.22,11.64 74.07,9.79 74.07,4.63 X6.2
N$41
  Top 0.508: LED5.A 19.12,10.9 20.14,11.92 R20.1
N$44
  Top 0.508: R21.1 17.78,11.46 17.51,11.18 LED6.A
N$49
  Top 0.508: R22.1 15.61,12.58 15.61,11.23 15.87,10.97 LED7.A
N$50
  Top 0.508: LED8.A 14.22,11.18 13.61,11.78 13.61,16.87 14.25,17.5 R23.1
N$51
  Top 0.508: R24.1 14.11,19.89 12.65,18.43 LED9.A
N$52
  Top 0.508: LED10.A 10.99,11.16 11.61,11.78 11.61,19.43 14.46,22.28 R25.1
RX-RFID  (via drill 0.5)
  Top 0.508: R27.1 58.98,28.26 57.75,29.49 v54.33,29.49
  Bottom 0.508: U$1.D19 50.71,33.07 50.71,30.96 51.14,30.53 53.28,30.53 v54.33,29.49
TX-RFID  (via drill 0.5)
  Top 0.508: R26.1 v64.68,16.46 v64.67,16.46
  Bottom 0.508: U$1.D18 54.33,34.34 55.77,32.89 55.77,26.53 60.57,21.73 60.57,18.59 61.51,17.65 63.49,17.65 v64.67,16.46
V_USB
  Bottom 1.016: R29.2 27.84,57 | 27.84,57 U$5.1 | 27.84,57 27.79,57.06 27.79,60.11 D5.A 27.79,63.65 28.96,64.82 U$1.+5V.2 U$1.+5V.1
VCC-ISO
  Top 1.27: 1.72,26.46 1.72,66.52 3.66,68.45 U$2.IN+ | 1.72,18.87 1.72,26.46 | X4.10 3.06,12.37 1.72,13.7 1.72,18.87 | X4.8 3.14,17.45 1.72,18.87 | X4.5 3.12,25.07 1.72,26.46
  Bottom 1.27: U$2.IN+ 4.43,63.18 6.87,60.74 D4.C
(copper drawn outside any net)
  shapes: Top area x2

### Text on the board
tNames: IN+ | POWER INPUT | IN- | LIM1 | LIM2 | LIM3 | LIM4 | IN+ | LIM5 | LIMIT SWITCH | LIM6 | IN+ | CASH PICKUP / DE-100 | LIM7 | IN+ | V0.03 | GND | RX1 | TX1 | VCC | GND | D20 | VCC | LIM7 | LIM6 | LIM5 | LIM4 | LIM1 | LIM2 | LIM3 | RFID | DHT SENSOR
bNames: Designed by: